# Altium schematic sheet Flow_Pump显示板.SchDoc
size C; SheetNumber: 4; SheetTotal: 14
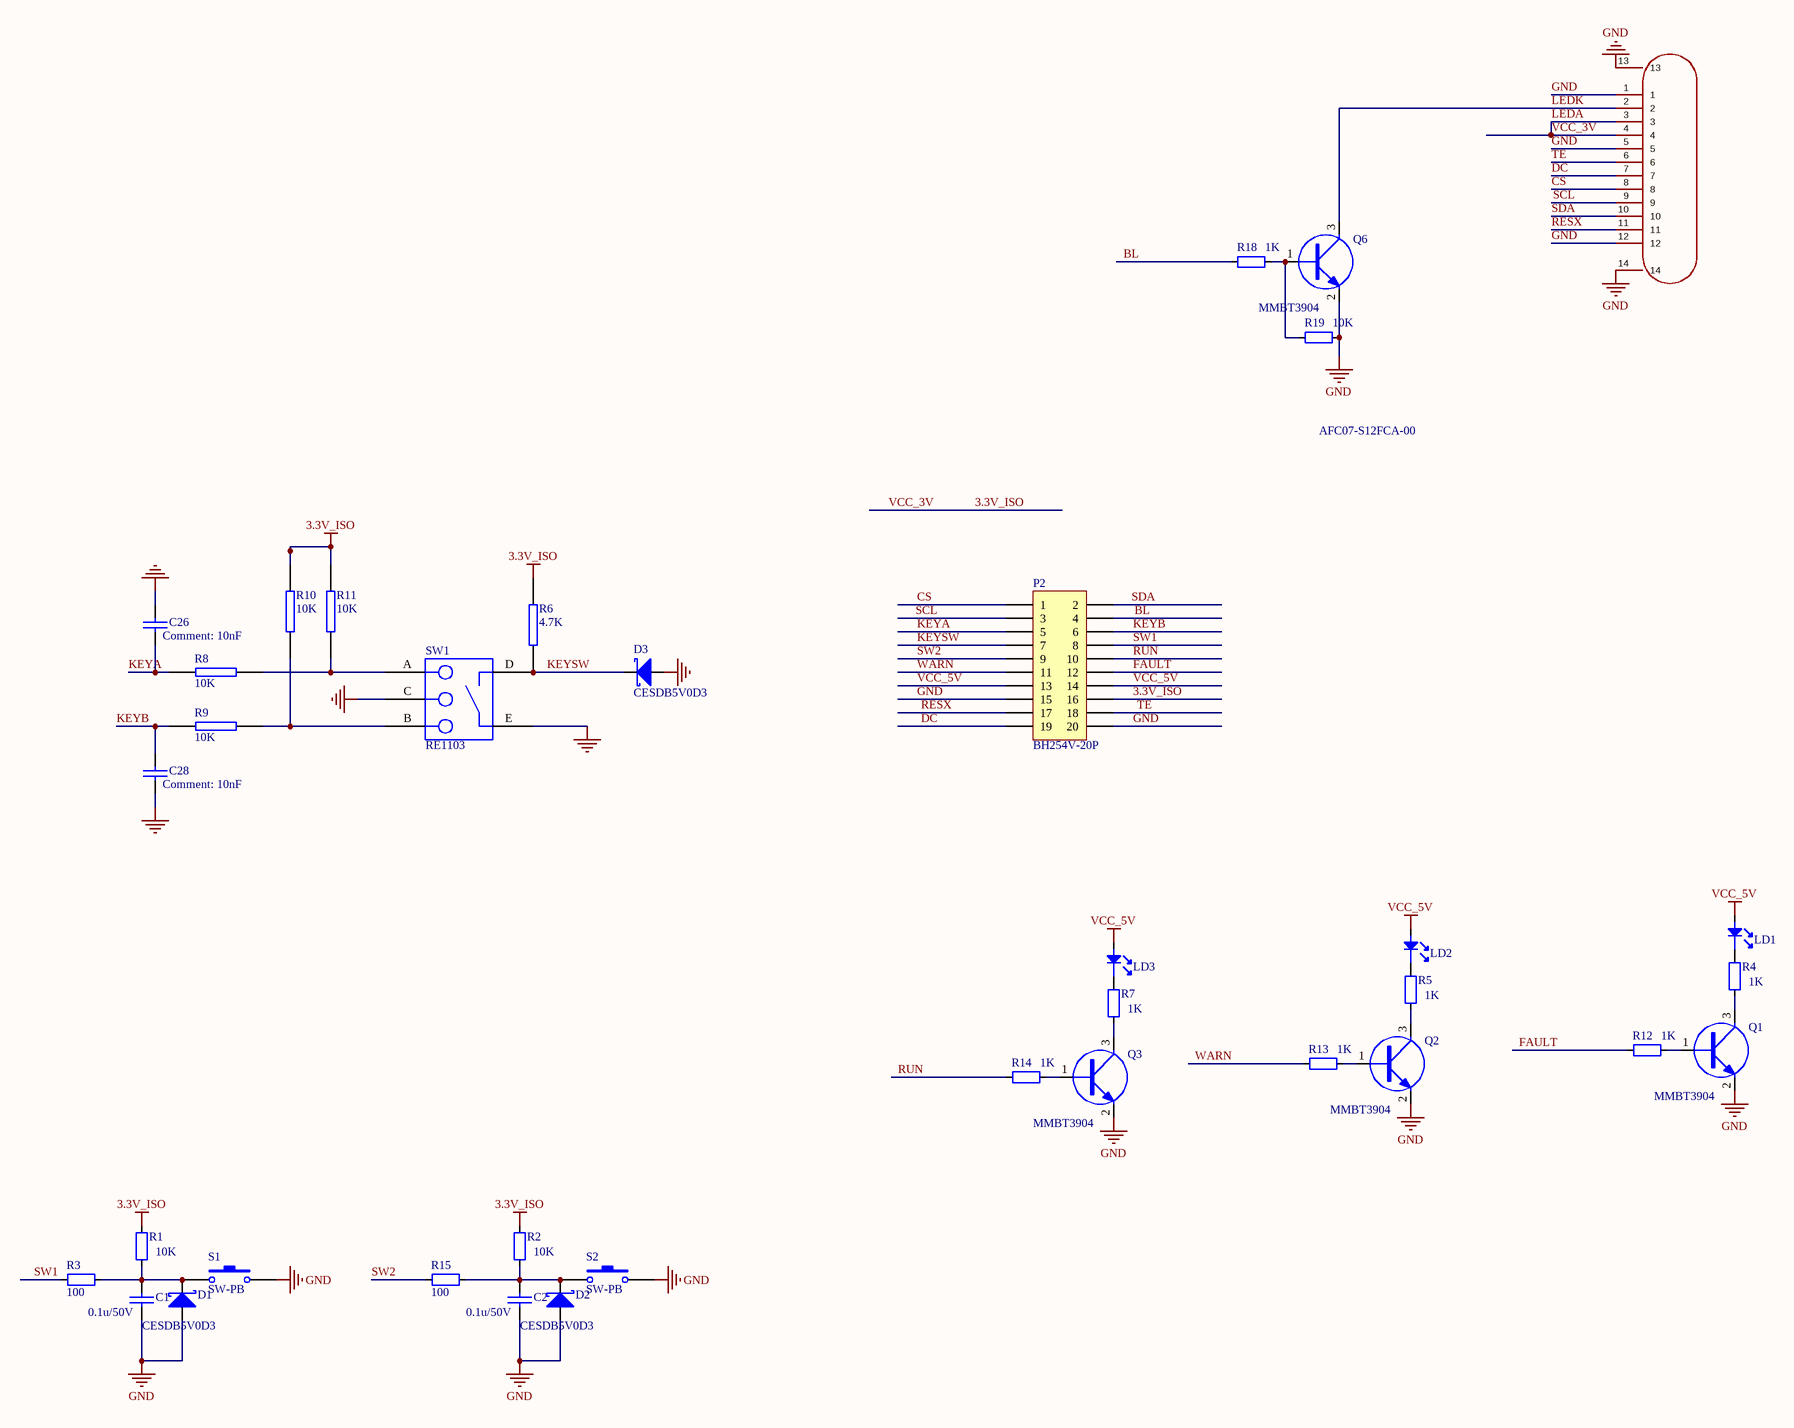
[diagram p0: Flow_Pump显示板.SchDoc]

## Parts
C1  value 0.1u/50V  [0603C]  (hidden comment: 1uF/25V)
C2  value 0.1u/50V  [0603C]  (hidden comment: 1uF/25V)
C26  10nF  [0603C]
C28  10nF  [0603C]
D1  CESDB5V0D3  [SOD323]
D2  CESDB5V0D3  [SOD323]
D3  CESDB5V0D3  [SOD323]
FPC1  AFC07-S12FCA-00  [FPC-SMD_12P-P0.50_AFC07-S12FCA-00]
LD1  LED_Green_19-217  [0603led]  (value not drawn)
LD2  LED_Green_19-217  [0603led]  (value not drawn)
LD3  LED_Green_19-217  [0603led]  (value not drawn)
P2  BH254V-20P  [DC-2.54-L-Z-20P]
Q1  MMBT3904  [SOT23-3]
Q2  MMBT3904  [SOT23-3]
Q3  MMBT3904  [SOT23-3]
Q6  MMBT3904  [SOT23-3]
R1  10K  [0603r]
R2  10K  [0603r]
R3  100  [0603r]
R4  1K  [0603r]
R5  1K  [0603r]
R6  4.7K  [0603R]
R7  1K  [0603r]
R8  10K  [0603R]
R9  10K  [0603R]
R10  10K  [0603R]
R11  10K  [0603R]
R12  1K  [0603r]
R13  1K  [0603r]
R14  1K  [0603r]
R15  100  [0603r]
R18  1K  [0603r]
R19  10K  [0603r]
S1  SW-PB  [TSW SMD-6*6*8]
S2  SW-PB  [TSW SMD-6*6*8]
SW1  RE1103  [EX1103S-D2-10]

## Nets
3.3V_ISO: FPC1.3 FPC1.4 P2.16 R1.1 R2.1 R6.1 R10.2 R11.2  [also labelled LEDA, VCC_3V]
GND: C1.1 C2.1 C26.1 C28.2 D1.1(A) D2.1(A) D3.1(A) FPC1.1 FPC1.5 FPC1.12 FPC1.13 FPC1.14 P2.15 P2.20 Q1.2(E) Q2.2(E) Q3.2(E) Q6.2(E) R19.2 S1.2 S2.2 SW1.C SW1.E
VCC_5V: LD1.1 LD2.1 LD3.1 P2.13 P2.14
BL: P2.4 R18.1
CS: FPC1.8 P2.1
DC: FPC1.7 P2.19
FAULT: P2.12 R12.1
KEYA: C26.2 P2.5 R8.1
KEYB: C28.1 P2.6 R9.1
KEYSW: D3.2(K) P2.7 R6.2 SW1.D
LEDK: FPC1.2 Q6.3(C)
RESX: FPC1.11 P2.17
RUN: P2.10 R14.1
SCL: FPC1.9 P2.3
SDA: FPC1.10 P2.2
SW1: P2.8 R3.1
SW2: P2.9 R15.1
TE: FPC1.6 P2.18
WARN: P2.11 R13.1
NetC1_2: C1.2 D1.2(K) R1.2 R3.2 S1.1
NetC2_2: C2.2 D2.2(K) R2.2 R15.2 S2.1
NetLD1_2: LD1.2 R4.1
NetLD2_2: LD2.2 R5.1
NetLD3_2: LD3.2 R7.1
NetQ1_1: Q1.1(B) R12.2
NetQ1_3: Q1.3(C) R4.2
NetQ2_1: Q2.1(B) R13.2
NetQ2_3: Q2.3(C) R5.2
NetQ3_1: Q3.1(B) R14.2
NetQ3_3: Q3.3(C) R7.2
NetQ6_1: Q6.1(B) R18.2 R19.1
NetR8_2: R8.2 R11.1 SW1.A
NetR9_2: R9.2 R10.1 SW1.B

## Library data of the parts
C1 C2 = CAP
C26 C28 = CAP: Capacitor; Value: 10nF
D1-D3 = DIODE S
LD1-LD3 = LED_Green_19-217: 物料主编码(PN): 100000032; Value: 19-217/G7C-AN1P2/3T; ID: 6; 序号: 33; 物料名称: 绿色LED; 物料描述: Other,LED,绿色,0603,1.6X0.8X0.4mm,19-217/G7C-AN1P2/3T; 工作温度: –40°C to 85°C; 制造商: Everlight; 器件等级: ——; 物料类型: 特殊二极管; 规格型号(完整型号): 19-217/G7C-AN1P2/3T
P2 = Header 10X2: Header, 10-Pin, Dual row; LatestRevisionDate: 17-Jul-2002; LatestRevisionNote: Re-released for DXP Platform.; Publisher: Altium Limited
Q1-Q3 Q6 = NPN_MMBT3904
R1-R5 R7 R12-R15 R18 R19 = RES0603: 物料主编码(PN): 150000040; ID: 233; 序号: 109; 物料名称: 贴片电阻; 精度: ±1%; 规格型号(完整型号): RC1608F103CS/RC0603FR-0710KL; 物料描述: RES,贴片电阻,0603,10k,±1%,1/10W,1.6X0.8X0.45mm,RC1608F103CS/RC0603FR-0710KL; 工作温度: –55°C to 155°C; 制造商: 三星/YAGEO; 器件等级: ——; 物料类型: 表贴电阻; 参数值: 1.00E+04
  R1 R2 R19: Value: 10K
  R3 R15: Value: 100
  R4 R5 R7 R12-R14 R18: Value: 1K
R6 R8-R11 = RES2
  R6: Value: 4.7K
  R8-R11: Value: 10K
S1 S2 = SW-PB: Switch; Published: 24-Mar-1999; LatestRevisionDate: 17-Jul-2002; LatestRevisionNote: Re-released for DXP Platform.; PackageReference: SPST-2; Publisher: Altium Limited
FPC1 = AFC07-S12FCA-00: Symbol: AFC07-S12FCA-00